# Altium schematic sheet ice40_MotherBoard.SchDoc
size A3; Organization: Altium Limited; Address1: 75 Boul de Mortagne; Address2: Boucherville; Address3: J4B 6Y4; Address4: Canada; ResearchCenter: EME
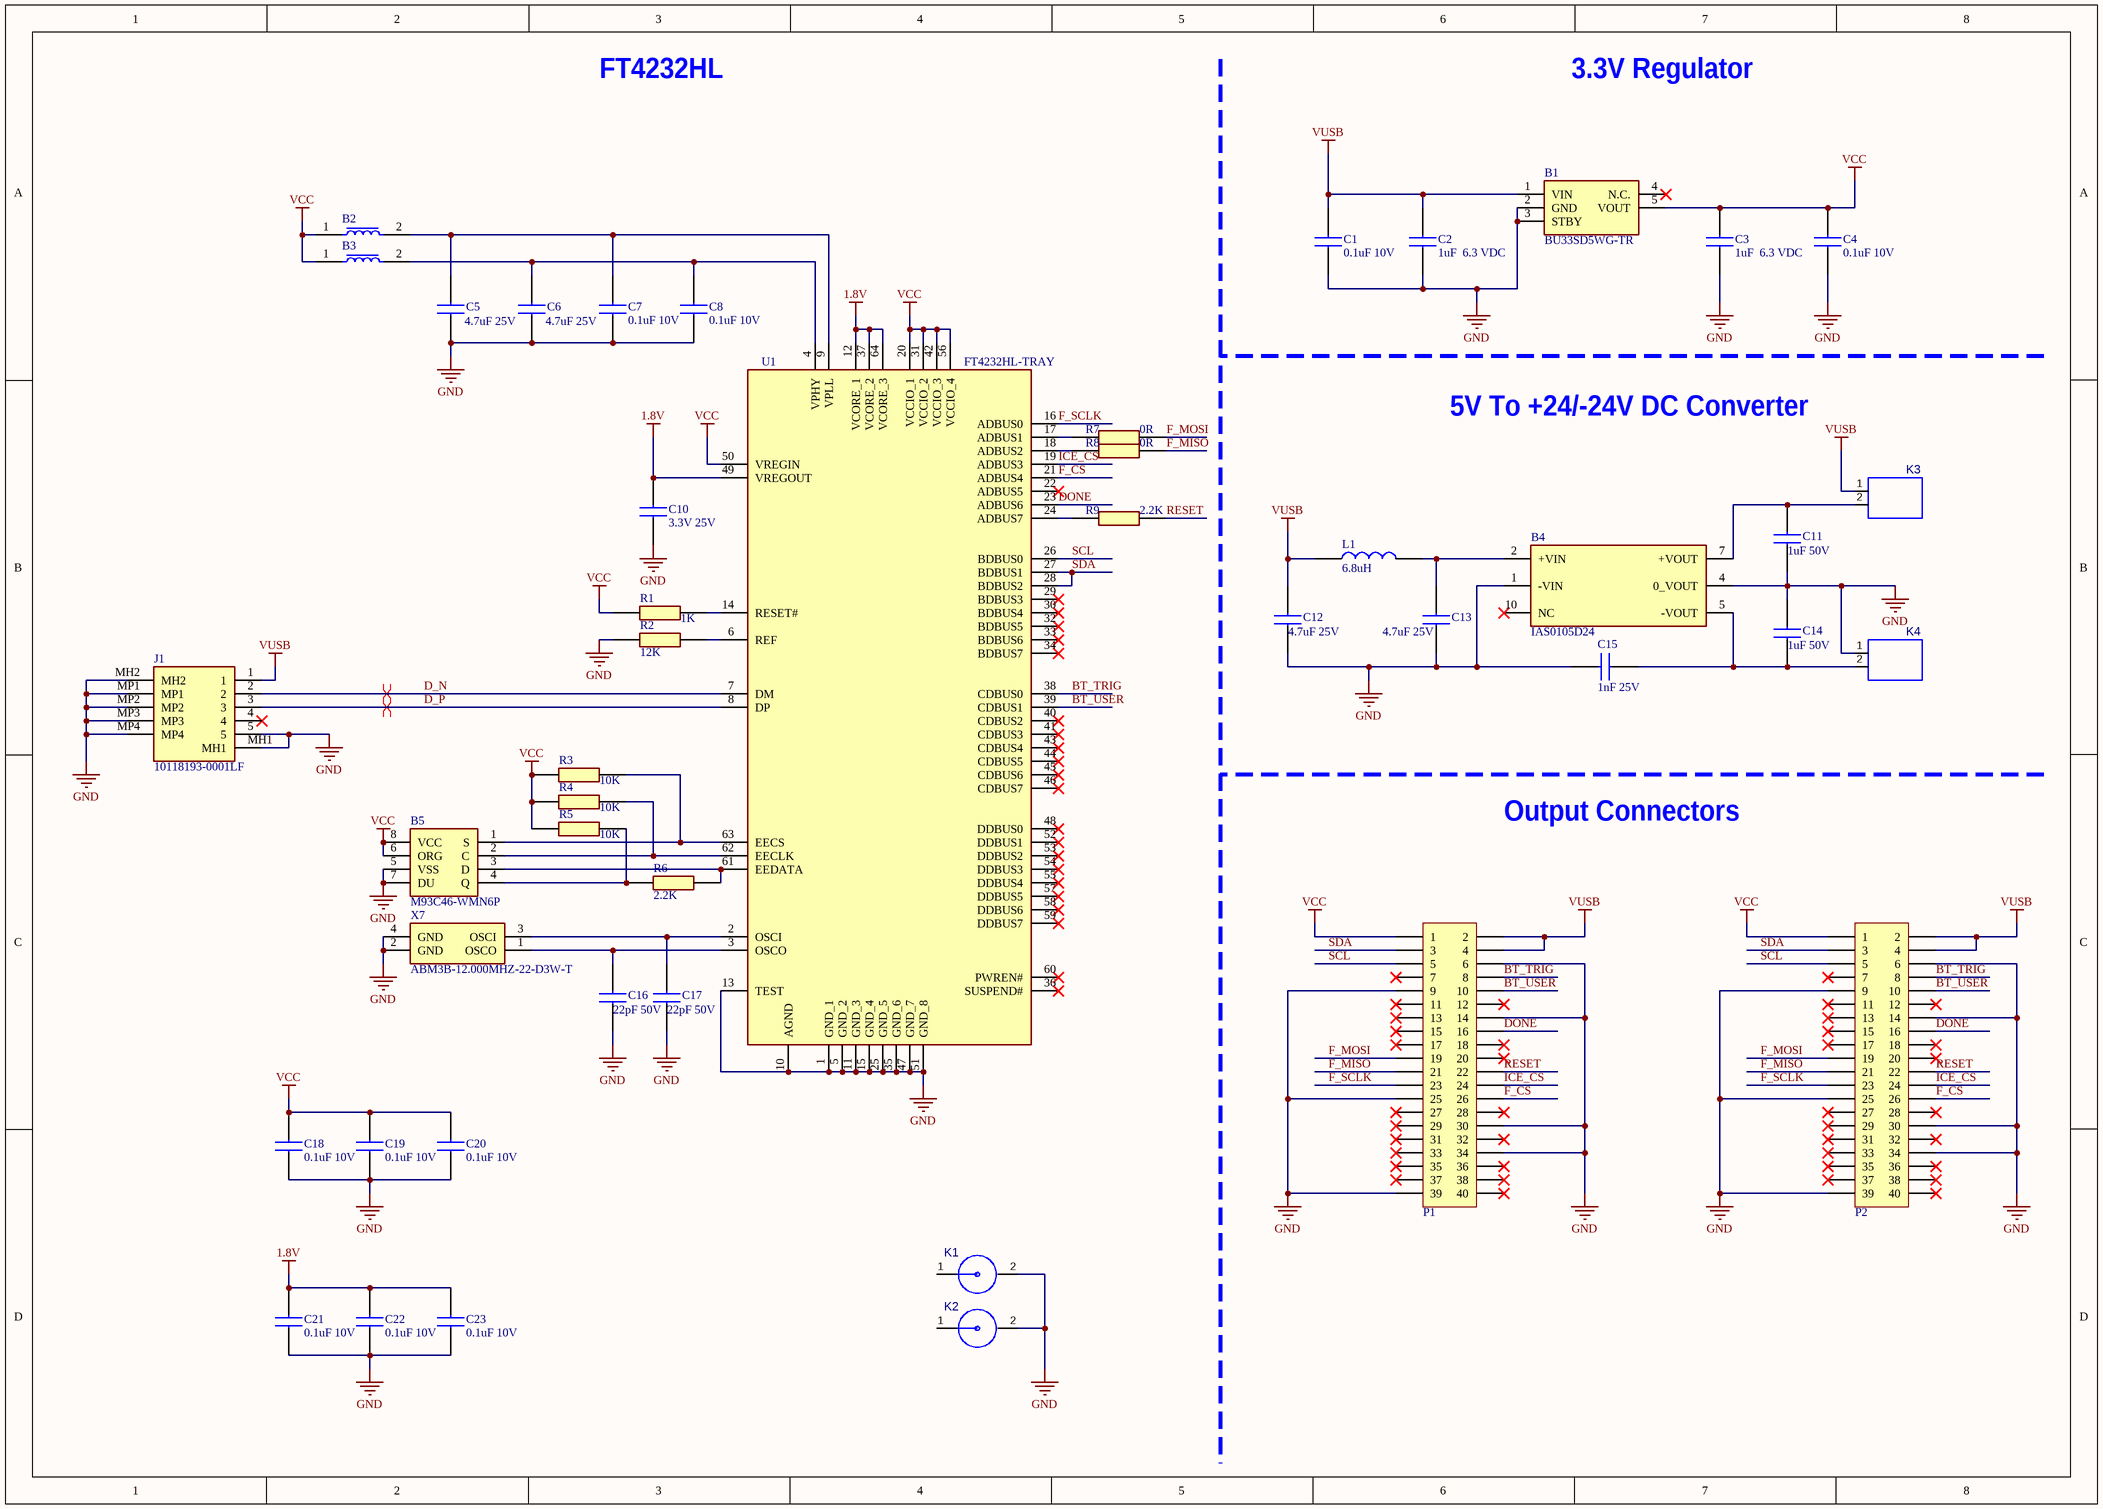
[diagram p0: ice40_MotherBoard.SchDoc]

## Parts
B1  BU33SD5WG-TR  [SOT95P280X125-5N_]
B2  BLM21AG102SN1D  [BLM21AG102BH1J]  (value not drawn)
B3  BLM21AG102SN1D  [BLM21AG102BH1J]  (value not drawn)
B4  IAS0105D24  [IAS0105D15_]
B5  M93C46-WMN6P  [SOIC127P600X175-8N]
C1  0.1uF 10V  [C0805]
C2  1uF  6.3 VDC  [C0805]
C3  1uF  6.3 VDC  [C0805]
C4  0.1uF 10V  [C0805]
C5  4.7uF 25V  [C0805]
C6  4.7uF 25V  [C0805]
C7  0.1uF 10V  [C0805]
C8  0.1uF 10V  [C0805]
C10  3.3V 25V  [C0805]
C11  1uF 50V  [C0805]
C12  4.7uF 25V  [C0805]
C13  4.7uF 25V  [C0805]
C14  1uF 50V  [C0805]
C15  1nF 25V  [C0805]
C16  22pF 50V  [C0805]
C17  22pF 50V  [C0805]
C18  0.1uF 10V  [C0805]
C19  0.1uF 10V  [C0805]
C20  0.1uF 10V  [C0805]
C21  0.1uF 10V  [C0805]
C22  0.1uF 10V  [C0805]
C23  0.1uF 10V  [C0805]
J1  10118193-0001LF  [101181930001LF]
K1  SMA_Edge  [AMPHENOL_132357-11_]  (value not drawn)
K2  SMA_Edge  [AMPHENOL_132357-11_]  (value not drawn)
K3  1x2PLS  [55342061_]  (value not drawn)
K4  1x2PLS  [55342061_]  (value not drawn)
L1  6.8uH  [INDC2012X110N_]
P1  2x20 2.54mm vertical  [RHDR40W97P254X254_2X20_5130X508X860P_]  (value not drawn)
P2  2x20 2.54mm vertical  [RHDR40W97P254X254_2X20_5130X508X860P_]  (value not drawn)
R1  1K  [6-0805_M]
R2  12K  [6-0805_M]
R3  10K  [6-0805_M]
R4  10K  [6-0805_M]
R5  10K  [6-0805_M]
R6  2.2K  [6-0805_M]
R7  0R  [0603-R]
R8  0R  [0603-R]
R9  2.2K  [6-0805_M]
U1  FT4232HL-TRAY  [QFP50P1200X1200X160-64N]
X7  ABM3B-12.000MHZ-22-D3W-T  [ABM3B]

## Nets
1.8V: C10.2 C21.2 C22.2 C23.2 U1.12(VCORE_1) U1.37(VCORE_2) U1.49(VREGOUT) U1.64(VCORE_3)
GND: B1.2(GND) B1.3(STBY) B4.1(-VIN) B4.4(0_VOUT) B5.5(VSS) B5.7(DU) C1.1 C2.1 C3.1 C4.1 C5.1 C6.1 C7.1 C8.1 C10.1 C11.1 C12.1 C13.1 C14.2 C15.1 C16.1 C17.1 C18.1 C19.1 C20.1 C21.1 C22.1 C23.1 J1.5 J1.MH1 J1.MH2 J1.MP1 J1.MP2 J1.MP3 J1.MP4 K1.2 K2.2 K4.1 P1.6 P1.9 P1.14 P1.25 P1.30 P1.34 P1.39 P2.6 P2.9 P2.14 P2.25 P2.30 P2.34 P2.39 R2.1 U1.1(GND_1) U1.5(GND_2) U1.10(AGND) U1.11(GND_3) U1.13(TEST) U1.15(GND_4) U1.25(GND_5) U1.35(GND_6) U1.47(GND_7) U1.51(GND_8) X7.2(GND) X7.4(GND)
VCC: B1.5(VOUT) B2.1 B3.1 B5.6(ORG) B5.8(VCC) C3.2 C4.2 C18.2 C19.2 C20.2 P1.1 P2.1 R1.1(R1) R3.2 R4.1 R5.1 U1.20(VCCIO_1) U1.31(VCCIO_2) U1.42(VCCIO_3) U1.50(VREGIN) U1.56(VCCIO_4)
VUSB: B1.1(VIN) C1.2 C2.2 C12.2 J1.1 K3.1 L1.1 P1.2 P1.4 P2.2 P2.4
BT_TRIG: P1.8 P2.8 U1.38(CDBUS0)
BT_USER: P1.10 P2.10 U1.39(CDBUS1)
D_N: J1.2 U1.7(DM)
D_P: J1.3 U1.8(DP)
DONE: P1.16 P2.16 U1.23(ADBUS6)
F_CS: P1.26 P2.26 U1.21(ADBUS4)
F_MISO: P1.21 P2.21 R8.2(R2)
F_MOSI: P1.19 P2.19 R7.2(R2)
F_SCLK: P1.23 P2.23 U1.16(ADBUS0)
ICE_CS: P1.24 P2.24 U1.19(ADBUS3)
RESET: P1.22 P2.22 R9.2
SCL: P1.5 P2.5 U1.26(BDBUS0)
SDA: P1.3 P2.3 U1.27(BDBUS1) U1.28(BDBUS2)
NetB2_2: B2.2 C5.2 C7.2 U1.9(VPLL)
NetB3_2: B3.2 C6.2 C8.2 U1.4(VPHY)
NetB4_2: B4.2(+VIN) C13.2 L1.2
NetB4_5: B4.5(-VOUT) C14.1 C15.2 K4.2
NetB4_7: B4.7(+VOUT) C11.2 K3.2
NetB5_1: B5.1(S) R3.1 U1.63(EECS)
NetB5_2: B5.2(C) R4.2 U1.62(EECLK)
NetB5_3: B5.3(D) R6.2 U1.61(EEDATA)
NetB5_4: B5.4(Q) R5.2 R6.1
NetC16_2: C16.2 U1.3(OSCO) X7.1(OSCO)
NetC17_2: C17.2 U1.2(OSCI) X7.3(OSCI)
NetR1_2: R1.2(R2) U1.14(RESET#)
NetR2_2: R2.2 U1.6(REF)
NetR7_1: R7.1(R1) U1.17(ADBUS1)
NetR8_1: R8.1(R1) U1.18(ADBUS2)
NetR9_1: R9.1 U1.24(ADBUS7)

Not connected (* = marked no-connect by the designer): B1 4(N.C.)*; B4 10(NC)*; J1 4*; K1 1; K2 1; P1 7* 11* 12* 13* 15* 17* 18* 20* 27* 28* 29* 31* 32* 33* 35* 36* 37* 38* 40*; P2 7* 11* 12* 13* 15* 17* 18* 20* 27* 28* 29* 31* 32* 33* 35* 36* 37* 38* 40*; U1 22(ADBUS5)* 29(BDBUS3)* 30(BDBUS4)* 32(BDBUS5)* 33(BDBUS6)* 34(BDBUS7)* 36(SUSPEND#)* 40(CDBUS2)* 41(CDBUS3)* 43(CDBUS4)* 44(CDBUS5)* 45(CDBUS6)* 46(CDBUS7)* 48(DDBUS0)* 52(DDBUS1)* 53(DDBUS2)* 54(DDBUS3)* 55(DDBUS4)* 57(DDBUS5)* 58(DDBUS6)* 59(DDBUS7)* 60(PWREN#)*

## Layout directives
differential pair: D_N, D_P

## Notes on the sheet
- FT4232HL
- 3.3V Regulator
- 5V To +24/-24V DC Converter
- Output Connectors

## Library data of the parts
B1 = BU33SD5WG-TR: LDO regulator,3.3V,0.5A,standby,SSOP5 ROHM BU33SD5WG-TR, LDO Voltage Regulator, 0.5A, 3.3 V +/-2%, 1.7  6 Vin, 5-Pin SSOP; Manufacturer_Name: ROHM Semiconductor; Geometry.Height: 1.25mm; Manufacturer_Part_Number: BU33SD5WG-TR; Mouser Part Number: 755-BU33SD5WG-TR; Mouser Price/Stock: https://www.mouser.co.uk/ProductDetail/ROHM-Semiconductor/BU33SD5WG-TR?qs=%2FKR40Cd6GUrQDzRkUEt69Q%3D%3D; Arrow Part Number: *; Arrow Price/Stock: *; Datasheet Link: https://componentsearchengine.com/Datasheets/1/BU33SD5WG-TR.pdf
B2 B3 = BLM21AG102SN1D: BLM21_N1D Series EMI Suppression Filter 1000+/-25% at 100MHz 600mA @85; Manufacturer_Name: Murata Electronics; Geometry.Height: 1.05mm; Manufacturer_Part_Number: BLM21AG102SN1D; Mouser Part Number: 81-BLM21AG102SN1; Mouser Price/Stock: https://www.mouser.co.uk/ProductDetail/Murata-Electronics/BLM21AG102SN1D?qs=OoMRb4U3ghiVKbYhfeUHEA%3D%3D; Arrow Part Number: BLM21AG102SN1D; Arrow Price/Stock: https://www.arrow.com/en/products/blm21ag102sn1d/murata-manufacturing?region=nac; Datasheet Link: https://www.murata.com/en-us/products/productdetail?partno=BLM21AG102SN1%23
B4 = IAS0105D15: Isolated DC/DC Converters DC-DC, 1W, UNREGULATED, DUAL OUTPUT, SMD; Manufacturer_Name: XP POWER; Geometry.Height: 7.75mm; Manufacturer_Part_Number: IAS0105D15; Mouser Part Number: 209-IAS0105D15; Mouser Price/Stock: https://www.mouser.co.uk/ProductDetail/XP-Power/IAS0105D15?qs=Cb2nCFKsA8ol8aKojAQnyQ%3D%3D; Arrow Part Number: *; Arrow Price/Stock: *; Datasheet Link: https://www.xppower.com/portals/0/pdfs/SF_IAS01.pdf
B5 = M93C46-WMN6P: M93C46-WMN6P, Serial EEPROM Memory 1kbit, Serial-Microwire, 200ns 2.5  5.5 V, 8-Pin; Manufacturer_Name: STMicroelectronics; Geometry.Height: 1.75mm; Manufacturer_Part_Number: M93C46-WMN6P; Mouser Part Number: 511-M93C46-WMN6P; Mouser Price/Stock: https://www.mouser.co.uk/ProductDetail/STMicroelectronics/M93C46-WMN6P?qs=GGwmtXQPF%2FlC4u8YDwI7hg%3D%3D; Arrow Part Number: *; Arrow Price/Stock: *; Datasheet Link: http://www.st.com/st-web-ui/static/active/en/resource/technical/document/datasheet/CD00001142.pdf
C1 C4 C7 C8 C18-C23 = C0805C104K8RACAUTO: SMD Auto X7R, Ceramic, 0.1 uF, 10%, 10 VDC, 25 VDC, 125C, -55C, X7R, SMD, MLCC, Temperature Stable, Automotive Grade, 5 % , 10 GOhms, 11 mg, 0805, 2mm, 1.25mm, 0.78mm, 0.75mm, 0.5mm, 4000, 78  Weeks, 80; Manufacturer_Name: KEMET; Geometry.Height: 1.1mm; Manufacturer_Part_Number: C0805C104K8RACAUTO; Mouser Part Number: 80-C0805C104K8RAUTO; Mouser Price/Stock: https://www.mouser.co.uk/ProductDetail/KEMET/C0805C104K8RACAUTO?qs=ds50AKTGxA8vmn6TMGYnqg%3D%3D; Arrow Part Number: C0805C104K8RACAUTO; Arrow Price/Stock: https://www.arrow.com/en/products/c0805c104k8racauto/kemet-corporation?region=nac; Datasheet Link: https://content.kemet.com/datasheets/KEM_C1023_X7R_AUTO_SMD.pdf
C2 C3 = C0805C105K9RACTU: SMD Comm X7R, Ceramic, 1 uF, 10%, 6.3 VDC, 15.75 VDC, 125C, -55C, X7R, SMD, MLCC, Temperature Stable, Class II, 5 % , 500 MOhms, 13 mg, 0805, 2mm, 1.25mm, 1.25mm, 0.75mm, 0.5mm, 2500, 78  Weeks, 80; Manufacturer_Name: KEMET; Geometry.Height: 1.1mm; Manufacturer_Part_Number: C0805C105K9RACTU; Mouser Part Number: 80-C0805C105K9R; Mouser Price/Stock: https://www.mouser.co.uk/ProductDetail/KEMET/C0805C105K9RACTU?qs=Nnkldhwoc36daYb4WU%2Fecw%3D%3D; Arrow Part Number: C0805C105K9RACTU; Arrow Price/Stock: https://www.arrow.com/en/products/c0805c105k9ractu/kemet-corporation; Datasheet Link: https://content.kemet.com/datasheets/KEM_C1002_X7R_SMD.pdf
C5 C6 C12 C13 = C0805C475K3RACTU: SMD Comm X7R, Ceramic, 4.7 uF, 10%, 25 VDC, 62.5 VDC, 125C, -55C, X7R, SMD, MLCC, Temperature Stable, Class II, 10 % , 21.3 MOhms, 21 mg, 0805, 2mm, 1.25mm, 1.25mm, 0.75mm, 0.5mm, 2500, 78  Weeks, 80; Manufacturer_Name: KEMET; Geometry.Height: 1.1mm; Manufacturer_Part_Number: C0805C475K3RACTU; Mouser Part Number: 80-C0805C475K3RACTU; Mouser Price/Stock: https://www.mouser.co.uk/ProductDetail/KEMET/C0805C475K3RACTU?qs=PzGy0jfpSMsRb1o8vMQxfQ%3D%3D; Arrow Part Number: C0805C475K3RACTU; Arrow Price/Stock: https://www.arrow.com/en/products/c0805c475k3ractu/kemet-corporation?region=nac; Datasheet Link: https://content.kemet.com/datasheets/KEM_C1002_X7R_SMD.pdf
C10 = C2012X7R1E335K125AB: TDK 0805 C 3.3uF Ceramic Multilayer Capacitor, 25 V dc, +125C, X7R Dielectric, +/-10%; Geometry.Height: 0.75mm; Manufacturer_Name: TDK; Manufacturer_Part_Number: C2012X7R1E335K125AB; Mouser Part Number: 810-C2012X7R1E335K; Mouser Price/Stock: https://www.mouser.co.uk/ProductDetail/TDK/C2012X7R1E335K125AB?qs=NRhsANhppD%2FtCJRQfh%252BIMA%3D%3D; Arrow Part Number: *; Arrow Price/Stock: *; Datasheet Link: https://product.tdk.com/system/files/dam/doc/product/capacitor/ceramic/mlcc/catalog/mlcc_commercial_general_en.pdf
C11 C14 = C0805C105K5RACTU: SMD Comm X7R, Ceramic, 1 uF, 10%, 50 VDC, 125 VDC, 125C, -55C, X7R, SMD, MLCC, Temperature Stable, Class II, 10 % , 100 MOhms, 21 mg, 0805, 2mm, 1.25mm, 1.25mm, 0.75mm, 0.5mm, 2500, 78  Weeks, 80; Manufacturer_Name: KEMET; Geometry.Height: 1.1mm; Manufacturer_Part_Number: C0805C105K5RACTU; Mouser Part Number: 80-C0805C105K5R; Mouser Price/Stock: https://www.mouser.co.uk/ProductDetail/KEMET/C0805C105K5RACTU?qs=iP0bYSAMAFrBrUflcErrLQ%3D%3D; Arrow Part Number: C0805C105K5RACTU; Arrow Price/Stock: https://www.arrow.com/en/products/c0805c105k5ractu/kemet-corporation?region=nac; Datasheet Link: https://content.kemet.com/datasheets/KEM_C1002_X7R_SMD.pdf
C15 = C0805C102K8RACTU: SMD Comm X7R, Ceramic, 1000 pF, 10%, 10 VDC, 25 VDC, 125C, -55C, X7R, SMD, MLCC, Temperature Stable, Class II, 5 % , 100 GOhms, 11 mg, 0805, 2mm, 1.25mm, 0.78mm, 0.75mm, 0.5mm, 4000, 78  Weeks, 80; Manufacturer_Name: KEMET; Geometry.Height: 1.1mm; Manufacturer_Part_Number: C0805C102K8RACTU; Mouser Part Number: 80-C0805C102K8R; Mouser Price/Stock: https://www.mouser.co.uk/ProductDetail/KEMET/C0805C102K8RACTU?qs=89eQnnNloViWkbrXkPqh5g%3D%3D; Arrow Part Number: C0805C102K8RACTU; Arrow Price/Stock: https://www.arrow.com/en/products/c0805c102k8ractu/kemet-corporation; Datasheet Link: https://content.kemet.com/datasheets/KEM_C1002_X7R_SMD.pdf
C16 C17 = C0805C220F5GACTU: SMD Comm C0G, Ceramic, 22 pF, 1%, 50 VDC, 125 VDC, 125C, -55C, C0G, SMD, MLCC, Ultra-Stable, Low Loss, Class I, 0.1 % , 100 GOhms, 8 mg, 0805, 2mm, 1.25mm, 0.7mm, 0.75mm, 0.5mm, 4000, 78  Weeks, 120; Manufacturer_Name: KEMET; Geometry.Height: 1.1mm; Manufacturer_Part_Number: C0805C220F5GACTU; Mouser Part Number: 80-C0805C220F5G; Mouser Price/Stock: https://www.mouser.co.uk/ProductDetail/KEMET/C0805C220F5GACTU/?qs=RXK%252BYb%252BisXRjMukjg6azjA%3D%3D; Arrow Part Number: C0805C220F5GACTU; Arrow Price/Stock: https://www.arrow.com/en/products/c0805c220f5gactu/kemet-corporation; Datasheet Link: https://content.kemet.com/datasheets/KEM_C1003_C0G_SMD.pdf
J1 = 10118193-0001LF: Connector; Manufacturer_Name: Amphenol Communications Solutions; Datasheet Link: https://cdn.amphenol-icc.com/media/wysiwyg/files/drawing/10118193.pdf; Height: 3.3mm; Manufacturer_Part_Number: 10118193-0001LF; Mouser Part Number: 649-10118193-0001LF; Mouser Price/Stock: https://www.mouser.co.uk/ProductDetail/Amphenol-FCI/10118193-0001LF?qs=Ywefl8B65e63Nsqd%252B8HZaQ%3D%3D; Arrow Part Number: 10118193-0001LF; Arrow Price/Stock: https://www.arrow.com/en/products/10118193-0001lf/amphenol-fci?region=nac
L1 = PE-0805CLH6R8STS: Fixed Inductors 0805 6.8uH 600mA DCR=420mOhms RF; Manufacturer_Name: Pulse; Geometry.Height: 1.1mm; Manufacturer_Part_Number: PE-0805CLH6R8STS; Mouser Part Number: 673-PE-0805CLH6R8STS; Mouser Price/Stock: https://www.mouser.co.uk/ProductDetail/Pulse-Electronics/PE-0805CLH6R8STS?qs=P1JMDcb91o4zi65tQL%252BIoA%3D%3D; Arrow Part Number: *; Arrow Price/Stock: *; Datasheet Link: https://www.mouser.com/datasheet/2/336/PLEI_S_A0011079421_1-2514267.pdf
P1 P2 = 2x20 2.54mm vertical: SSQ-110-02-G-D-RA; LatestRevisionDate: 17-Jul-2002; LatestRevisionNote: Re-released for DXP Platform.; Publisher: Altium Limited
R1 = ERJ-6GEYJ102V: RESISTOR, 0805 1K Ohm +/-5% 0.125 W; Manufacturer_Name: Panasonic; Manufacturer_Part_Number: ERJ-6GEYJ102V; Mouser Part Number: 667-ERJ-6GEYJ102V; Mouser Price/Stock: https://www.mouser.co.uk/ProductDetail/Panasonic/ERJ-6GEYJ102V?qs=tQNqqtTOejLZQ8YYVXgJXw%3D%3D; Arrow Part Number: ERJ-6GEYJ102V; Arrow Price/Stock: https://www.arrow.com/en/products/erj-6geyj102v/panasonic?region=europe; Datasheet Link: *
R2 = ERJ-P06F1202V: Thick Film Resistors - SMD 0805 12Kohms 0.5W 1% AEC-Q200; Manufacturer_Name: Panasonic; Geometry.Height: 0.7mm; Manufacturer_Part_Number: ERJ-P06F1202V; Mouser Part Number: 667-ERJ-P06F1202V; Mouser Price/Stock: https://www.mouser.com/Search/Refine.aspx?Keyword=667-ERJ-P06F1202V; Arrow Part Number: ERJ-P06F1202V; Arrow Price/Stock: https://www.arrow.com/en/products/erj-p06f1202v/panasonic; Datasheet Link: https://industrial.panasonic.com/cdbs/www-data/pdf/RDO0000/AOA0000C331.pdf
R3-R5 = RC0805DR-072K2L: Resistor - SMD 10 kOhms 0805; Manufacturer_Name: YAGEO; Geometry.Height: 0.6mm; Manufacturer_Part_Number: RC0805DR-072K2L; Mouser Part Number: 603-RC0805DR-072K2L; Mouser Price/Stock: https://www.mouser.co.uk/ProductDetail/YAGEO/RC0805DR-072K2L?qs=9h0bZHM%2F3zISsQK01v%2Fg%2FQ%3D%3D; Arrow Part Number: *; Arrow Price/Stock: *; Datasheet Link: https://www.yageo.com/upload/media/product/productsearch/datasheet/rchip/PYu-RC_Group_51_RoHS_L_11.pdf
R6 R9 = ERJ-P06F1202V: Thick Film Resistors - SMD 2.2 kOhms 125 mW 0805 1%; Manufacturer_Name: Panasonic; Geometry.Height: 0.7mm; Manufacturer_Part_Number: ERJ-P06F1202V; Mouser Part Number: 667-ERJ-P06F1202V; Mouser Price/Stock: https://www.mouser.com/Search/Refine.aspx?Keyword=667-ERJ-P06F1202V; Arrow Part Number: ERJ-P06F1202V; Arrow Price/Stock: https://www.arrow.com/en/products/erj-p06f1202v/panasonic; Datasheet Link: https://industrial.panasonic.com/cdbs/www-data/pdf/RDO0000/AOA0000C331.pdf
R7 R8 = ERJ-6GEYJ102V: RESISTOR, 0805 0R; Manufacturer_Name: Panasonic; Manufacturer_Part_Number: ERJ-6GEYJ102V; Mouser Part Number: 667-ERJ-6GEYJ102V; Mouser Price/Stock: https://www.mouser.co.uk/ProductDetail/Panasonic/ERJ-6GEYJ102V?qs=tQNqqtTOejLZQ8YYVXgJXw%3D%3D; Arrow Part Number: ERJ-6GEYJ102V; Arrow Price/Stock: https://www.arrow.com/en/products/erj-6geyj102v/panasonic?region=europe; Datasheet Link: *
U1 = FT4232HL-TRAY: IC USB HS QUAD UART/SYNC 64-LQFP; Manufacturer_Name: FTDI Chip; Geometry.Height: 1.6mm; Manufacturer_Part_Number: FT4232HL-TRAY; Mouser Part Number: 895-FT4232HL-TRAY; Mouser Price/Stock: https://www.mouser.co.uk/ProductDetail/FTDI/FT4232HL-TRAY?qs=LsYZF85lA7ZOH9FvmmPH7w%3D%3D; Arrow Part Number: FT4232HL-TRAY; Arrow Price/Stock: https://www.arrow.com/en/products/ft4232hl-tray/ftdi-chip; Datasheet Link: https://www.ftdichip.com/Support/Documents/DataSheets/ICs/DS_FT4232H.pdf
X7 = ABM3B-12.000MHZ-22-D3W-T: Crystals 12MHz 22pF 25ppm -40C +85C; Manufacturer_Name: ABRACON; Manufacturer_Part_Number: ABM3B-12.000MHZ-22-D3W-T; Mouser Part Number: 815-ABM3B-12-22-D3WT; Mouser Price/Stock: https://www.mouser.co.uk/ProductDetail/ABRACON/ABM3B-12000MHZ-22-D3W-T?qs=mdWnPU%2FGekgGoMnpT5iuLA%3D%3D; Arrow Part Number: *; Arrow Price/Stock: *; Datasheet Link: https://abracon.com/Resonators/abm3b.pdf
K1 K2 = SMA_Edge: Value: *
K3 K4 = 1x2PLS: Value: *